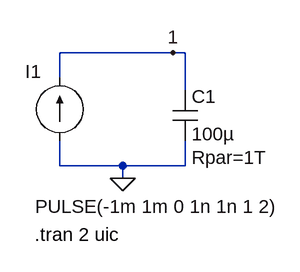
[diagram p0: schematic Fig_6-2_C-i-dt.asc]
Fig_6-2_C-i-dt.asc, the LTspice schematic file:
Version 4
SHEET 1 880 680
WIRE 256 80 112 80
WIRE 272 80 256 80
WIRE 112 112 112 80
WIRE 272 128 272 80
WIRE 112 224 112 192
WIRE 192 224 112 224
WIRE 272 224 272 192
WIRE 272 224 192 224
WIRE 192 240 192 224
FLAG 192 240 0
FLAG 256 80 1
SYMBOL cap 256 128 R0
WINDOW 39 24 86 Left 2
SYMATTR SpiceLine Rpar=1T
SYMATTR InstName C1
SYMATTR Value 100µ
SYMBOL current 112 192 R180
WINDOW 0 24 88 Left 2
WINDOW 3 -274 -84 Left 2
WINDOW 123 0 0 Left 2
WINDOW 39 0 0 Left 2
SYMATTR InstName I1
SYMATTR Value PULSE(-1m 1m 0 1n 1n 1 2)
TEXT 80 312 Left 2 !.tran 2 uic

The netlist it stands for:
* Fig_6-2_C-i-dt.asc
C1 1 0 100µ Rpar=1T
I1 0 1 PULSE(-1m 1m 0 1n 1n 1 2)
.tran 2 uic
.backanno
.end